# EasyEDA Pro project ProPrj_CC-board_2026-02-09.epro

# Schematic Schematic1
Board Name: Board1; Create Date: 2025-12-28; Page Name: P1; Project Name: CC-board; Schematic Name: Schematic1; Update Date: 2025-12-28; Company: EasyEDA.com; Page Size: A4; Version: V1.0
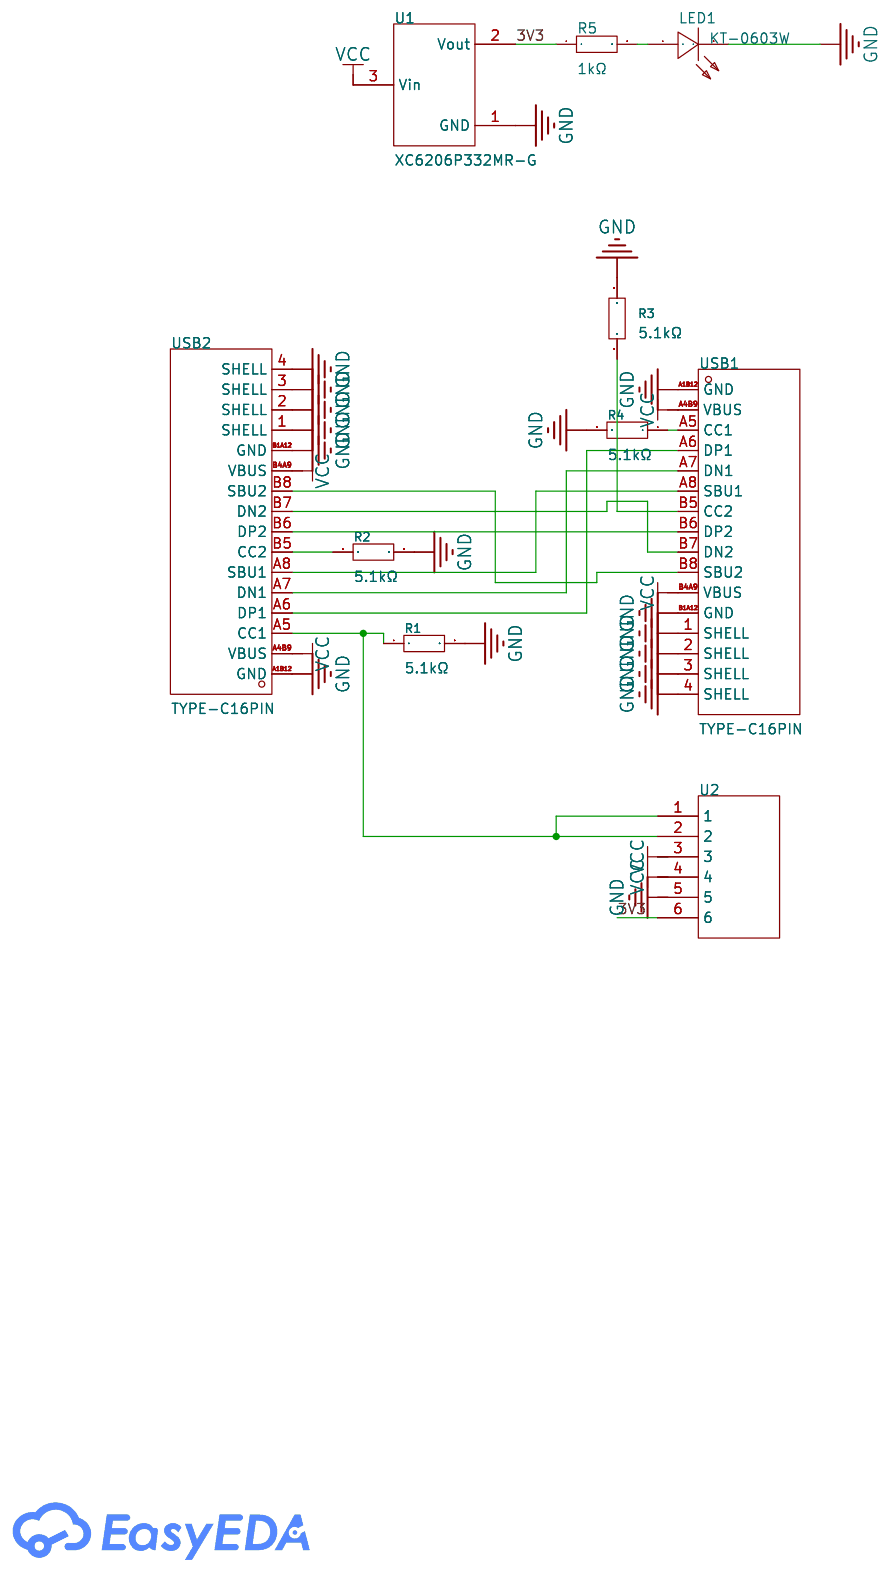
[diagram p0: schematic sheet]

## Parts
LED1  KT-0603W  [LED0603-R-RD_WHITE]
R1  5.1kΩ  [R0402]
R2  5.1kΩ  [R0402]
R3  5.1kΩ  [R0402]
R4  5.1kΩ  [R0402]
R5  1kΩ  [R0402]
U1  XC6206P332MR-G  [SOT-23-3_L2.9-W1.6-P1.90-LS2.8-BR]
U2  -  [tooth]
USB1  TYPE-C16PIN  [USB-C-SMD_TYPE-C16PIN]
USB2  TYPE-C16PIN  [USB-C-SMD_TYPE-C16PIN]

## Library data of the parts
LED1 = KT-0603W: Illumination Color:White Voltage - Forward(Vf):2.6V~3.1V Voltage - Forward(Vf):2.6V~3.1V Power(Watts):100mW Forward Current:5mA Diode Configuration:Discrete Diode Lens Color:Yellow Lens Luminous Intensity:360mcd Luminous Intensity:360mcd Viewing Angle:120; LCSC Part Name: 0603 白灯 高亮; Supplier Part: C2290; Manufacturer: KENTO; Supplier Footprint: 0603; JLCPCB Part Class: Basic Part; Datasheet: https://item.szlcsc.com/datasheet/KT-0603W/2663.html; Supplier: LCSC; Illumination Color: White; Voltage - Forward(Vf): 2.6V~3.1V; Power(Watts): 100mW; Forward Current: 5mA; Diode Configuration: Discrete Diode; Lens Color: Yellow Lens; Luminous Intensity: 360mcd; Viewing Angle: 120°; Mounting Style: Top-mount
R1-R4 = 0402WGF5101TCE: Type:Thick Film Resistor Resistance:5.1kΩ Tolerance:±1% Tolerance:±1% Power(Watts):62.5mW Voltage-Supply(Max):50V Temperature Coefficient:±100ppm/℃ Temperature Coefficient:±100ppm/℃ Operating Temperature:-55℃~+155℃ Operating Temperature:-55℃~+155℃; LCSC Part Name: 5.1kΩ ±1% 62.5mW 厚膜电阻; Supplier Part: C25905; Manufacturer: UNI-ROYAL(厚声); Supplier Footprint: 0402; JLCPCB Part Class: Basic Part; Datasheet: https://item.szlcsc.com/datasheet/0402WGF5101TCE/26648.html; Supplier: LCSC; Type: Thick Film Resistor; Tolerance: ±1%; Power(Watts): 62.5mW; Voltage-Supply(Max): 50V; Temperature Coefficient: ±100ppm/℃; Operating Temperature: -55℃~+155℃
R5 = 0402WGF1001TCE: Type:Thick Film Resistor Resistance:1kΩ Tolerance:±1% Tolerance:±1% Power(Watts):62.5mW Voltage-Supply(Max):50V Temperature Coefficient:±100ppm/℃ Temperature Coefficient:±100ppm/℃ Operating Temperature:-55℃~+155℃ Operating Temperature:-55℃~+155℃; LCSC Part Name: 1kΩ ±1% 62.5mW 厚膜电阻; Supplier Part: C11702; Manufacturer: UNI-ROYAL(厚声); Supplier Footprint: 0402; JLCPCB Part Class: Basic Part; Datasheet: https://item.szlcsc.com/datasheet/0402WGF1001TCE/12256.html; Supplier: LCSC; Type: Thick Film Resistor; Tolerance: ±1%; Power(Watts): 62.5mW; Voltage-Supply(Max): 50V; Temperature Coefficient: ±100ppm/℃; Operating Temperature: -55℃~+155℃
U1 = XC6206P332MR-G_C5446: Output Type:Fixed Voltage - Supply:6V Output Voltage:3.3V Output Voltage:3.3V Output Current:200mA Power Supply Rejection Ratio (PSRR):- Voltage Dropout:- standby current:1uA Noise:- Features:Over Current Protection Operating Temperature:-40℃~+85℃@(Ta) Op; LCSC Part Name: 输入6V 输出3.3V 200mA; Supplier Part: C5446; Manufacturer: TOREX(特瑞仕); Supplier Footprint: SOT-23-3L; JLCPCB Part Class: Basic Part; Datasheet: https://item.szlcsc.com/datasheet/XC6206P332MR-G/5896.html; Supplier: LCSC; Output Type: Fixed; Voltage - Supply: 6V; Output Voltage: 3.3V; Output Current: 200mA; standby current: 1uA; Features: Over Current Protection; Operating Temperature: -40℃~+85℃@(Ta); Output Configuration: Positive; Number of Outputs: 1
U2 = tooth
USB1 USB2 = TYPE-C16PIN: Connector Type:Type-C Protocol Standard:USB 3.1 Gender:Female Mounting Type:Surface Mount, Right Angle Number of Contacts:16P Number of Ports:1 Current Rating-Power:3A Voltage Rating:30V Connect-Disconnect Life:10,000 Cycles Detection color:Black Operatin; LCSC Part Name: Type-C 母 卧贴; Supplier Part: C393939; Manufacturer: SHOU HAN(首韩); Supplier Footprint: SMD; JLCPCB Part Class: Extended Part; Datasheet: https://item.szlcsc.com/datasheet/TYPE-C16PIN/372551.html; Supplier: LCSC; Connector Type: Type-C; Protocol Standard: USB 3.1; Gender: Female; Mounting Type: Surface Mount, Right Angle; Number of Contacts: 16P; Number of Ports: 1; Current Rating-Power: 3A; Voltage Rating: 30V; Connect-Disconnect Life: 10,000 Cycles; Detection color: Black; Operating Temperature: -40℃~+85℃

## Nets
3V3: R5.1 U1.2(Vout) U2.6
GND: LED1.2(K) R1.2 R2.2 R3.2 R4.2 U1.1(GND) U2.5 USB1.1(SHELL) USB1.2(SHELL) USB1.3(SHELL) USB1.4(SHELL) USB1.A1B12(GND) USB1.B1A12(GND) USB2.1(SHELL) USB2.2(SHELL) USB2.3(SHELL) USB2.4(SHELL) USB2.A1B12(GND) USB2.B1A12(GND)
VCC: U1.3(Vin) U2.3 U2.4 USB1.A4B9(VBUS) USB1.B4A9(VBUS) USB2.A4B9(VBUS) USB2.B4A9(VBUS)
$1N573: USB1.A7(DN1) USB2.A7(DN1)
$1N579: USB1.A6(DP1) USB2.A6(DP1)
$1N593: USB1.A8(SBU1) USB2.A8(SBU1)
$1N606: USB1.B6(DP2) USB2.B6(DP2)
$1N611: USB1.B7(DN2) USB2.B7(DN2)
$1N620: USB1.B8(SBU2) USB2.B8(SBU2)
$1N702: R2.1 USB2.B5(CC2)
$1N789: R4.1 USB1.A5(CC1)
$1N836: R3.1 USB1.B5(CC2)
$1N841: R1.1 U2.1 U2.2 USB2.A5(CC1)
$1N1290: LED1.1(A) R5.2

# Board PCB1
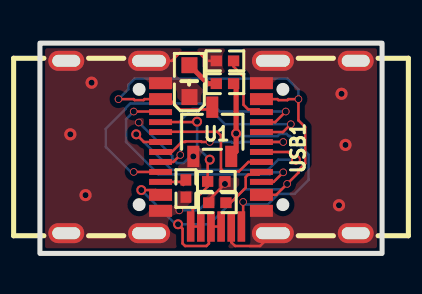
[diagram p1: board, top side]
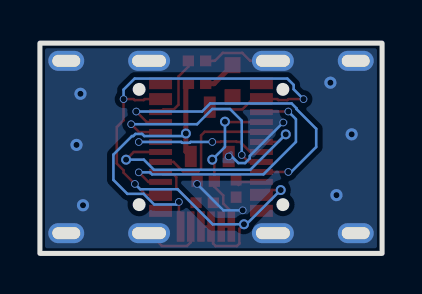
[diagram p2: board, bottom side, seen from below]

Outline 17.14 x 10.54 mm; copper layers: Top Layer, Bottom Layer. Coordinates in mm from the lower left corner of the outline.
Outline path: rectangle 0,10.54 17.14,0
Stack: Top Layer 0.035mm / Dielectric1 1.51mm FR4 er 4.5 / Bottom Layer 0.035mm

## Design rules (mm)
template: Custom Config
spacing copperThickness1oz (default): track to track 0.102, other pairs 0.127 to 0.3
spacing copperThickness2oz: track to track 0.203, other pairs 0.152 to 0.3
track width copperThickness1oz (default): min 0.127, default 0.254, max 2.54
track width copperThickness2oz: min 0.203, default 0.254, max 2.54
differential pair differentialPair (default): width min 0.127, default 0.254, max 2.54; gap min 0.152, default 0.152
via viaSize (default): diameter min 0.381, default 0.61, max 10; hole min 0.3, default 0.305, max 6.3
pour e439 uses copperRegion
pour e401 uses copperRegion

## Placement (name value [footprint] x y rotation side)
LED1  KT-0603W  [LED0603-R-RD_WHITE]  7.49 8.64 90 top
R1  5.1kΩ  [R0402]  8.84 3.61 0 top
R2  5.1kΩ  [R0402]  7.31 3.25 270 top
R3  5.1kΩ  [R0402]  9.27 9.65 180 top
R4  5.1kΩ  [R0402]  8.89 2.54 180 top
R5  1kΩ  [R0402]  9.27 8.51 180 top
U1  XC6206P332MR-G  [SOT-23-3_L2.9-W1.6-P1.90-LS2.8-BR]  8.64 6.1 270 top
U2  -  [tooth]  8.82 0.97 0 top
USB1  TYPE-C16PIN  [USB-C-SMD_TYPE-C16PIN]  13.46 5.33 90 top
USB2  TYPE-C16PIN  [USB-C-SMD_TYPE-C16PIN]  3.68 5.33 270 top

## Footprints (pads in the part's own frame, mm; a bottom-side part is the same pattern mirrored in y, then rotated)
LED0603-R-RD_WHITE
  rect 0.8x0.8 smd: 1(0.8,0) 2(-0.8,0)
R0402
  rect 0.566x0.54 smd: 1(-0.433,0) 2(0.433,0)
SOT-23-3_L2.9-W1.6-P1.90-LS2.8-BR
  rect 1.07x0.6 smd: 1(1.235,-0.95) 2(1.235,0.95) 3(-1.235,0)
tooth
  custom 0.381x1.524 smd: 1(-1.27,0.381) 2(-0.762,0.381) 3(-0.254,0.381) 4(0.254,0.381) 5(0.762,0.381) 6(1.27,0.381)
USB-C-SMD_TYPE-C16PIN
  oval 1x2.1 hole 0.6x1.7: 1(-4.32,1.788) 2(4.32,1.788)
  oval 1x1.8 hole 0.6x1.4: 3(-4.32,-2.362) 4(4.32,-2.362)
  rect 0.6x1.15 smd: A1B12(-3.2,2.362) A4B9(-2.4,2.362) B1A12(3.2,2.362) B4A9(2.4,2.362)
  rect 0.3x1.15 smd: A5(-1.25,2.362) A6(-0.25,2.362) A7(0.25,2.362) A8(1.25,2.362) B5(1.75,2.362) B6(0.75,2.362) B7(-0.75,2.362) B8(-1.75,2.362)

## Nets
As in the schematic.

## Via types
v1: diameter 0.61, hole 0.305, Top Layer to Bottom Layer, 6 vias
v2: diameter 0.381, hole 0.305, Top Layer to Bottom Layer, 16 vias
v3: diameter 0.5, hole 0.305, Top Layer to Bottom Layer, 7 vias

## Routing (per net, layer and track width the routed paths; a pad name or vN(x,y) marks a point on that pad's centre or on a via; arc(x,y) is an arc through that point)
3V3: length 14.3
  Top Layer w0.127: U2.6 10.18,1.44 v2(10.18,2.58)
  Top Layer w0.254: U1.2 9.83,5.11 v3(9.83,6.01) 9.83,8.51
  Bottom Layer w0.127: v3(9.83,6.01) 9.96,5.88 11.92,5.88 12.02,5.99 12.36,5.99 12.47,5.88 12.53,5.88 13.46,4.95 13.46,3.68 12.76,2.98 11.95,2.98 11.42,2.45 10.31,2.45 v2(10.18,2.58)
GND: length 14.8
  Top Layer w0.127: U2.5 9.59,0.56 9.78,0.37 11.03,0.37 USB1.1 ; R3.2 8.84,9.65 8.38,9.65 7.98,10.05 7,10.05 6.61,9.65 5.47,9.65 ; R4.2 8.46,2.67 v2(9.27,3.48)
  Bottom Layer w0.127: v2(7.69,4.86) 7.53,4.86 7.2,4.53 6.86,4.53 6.63,4.77 6.63,4.89 v2(4.95,6.56) ; v2(6.98,2.16) 7.95,2.16 v2(9.27,3.48)
  vias: v1(1.52,5.97) v1(2.29,2.92) v1(2.59,8.56) v1(14.99,2.41) v1(15.11,8) v1(15.31,5.44)
VCC: length 37.3
  Top Layer w0.127: 11.1,2.93 11.84,2.93 v2(12.39,3.48) 12.95,4.05 12.95,4.17 13.29,4.51 13.29,6.33 12.95,6.67 v2(12.95,7.73) 12.45,7.73 12.4,7.68 11.95,7.68 11.9,7.73 USB1.B4A9 ; v3(5.08,3.18) 5.8,3.18 6.05,2.93 ; U1.3 8.6,7.33 8.49,7.22 7,7.22 6.49,7.73 USB2.A4B9 5.25,7.73 5.19,7.68 4.75,7.68 4.7,7.73 v2(3.94,7.73) ; U2.4 U2.3 8.47,1.25 8.47,0.5 8.34,0.37 7.27,0.37 7.15,0.5 7.15,1.23 v3(6.92,1.46)
  Bottom Layer w0.127: v2(12.39,3.48) 12.12,3.21 10.24,3.21 8.49,1.46 v3(6.92,1.46) 6.79,1.46 v3(5.08,3.18) ; v2(3.94,7.73) 4.43,8.23 4.43,8.45 4.75,8.76 12.4,8.76 12.95,8.21 v2(12.95,7.73)
$1N573: length 7.5
  Top Layer w0.127: v2(8.51,5.59) 8.1,5.59 8.08,5.61 7.3,5.61 7.27,5.59 7.11,5.59 6.61,5.08 USB2.A7 ; USB1.A7 v2(12.19,5.58)
  Bottom Layer w0.127: v2(12.19,5.58) 12.19,5.59 10.07,5.59 10.02,5.55 9.64,5.55 9.59,5.59 v2(8.51,5.59)
$1N579: length 12.2
  Top Layer w0.127: USB2.A6 5.21,5.58 v3(4.83,5.97) ; USB1.A6 12.44,5.08 v3(12.83,4.7)
  Bottom Layer w0.127: v3(12.83,4.7) 11.94,4.7 11.43,4.19 6.6,4.19 v3(4.83,5.97)
$1N593: length 15.3
  Top Layer w0.127: USB1.A8 11.79,6.58 v2(12.32,7.11) ; USB2.A8 v2(4.7,4.08)
  Bottom Layer w0.127: v2(4.7,4.08) 4.55,4.08 3.3,5.33 3.3,6.25 4.29,7.24 4.29,7.28 4.53,7.52 8.61,7.52 9.02,7.11 v2(12.32,7.11)
$1N606: length 10.6
  Top Layer w0.127: v2(7.03,4.93) 6.68,4.58 USB2.B6 ; v2(12.57,6.48) 12.18,6.08 USB1.B6
  Bottom Layer w0.127: v2(12.57,6.48) 9.27,6.48 8.51,7.24 7.62,7.24 7.03,6.65 v2(7.03,4.93)
$1N611: length 7.1
  Top Layer w0.127: USB1.B7 10.45,4.58 9.97,4.11 9.2,4.11 9.07,4.24 9.07,5.92 8.89,6.1 6.06,6.1 USB2.B7
$1N620: length 12.9
  Top Layer w0.127: v2(12.19,4.06) 11.71,3.58 USB1.B8 ; USB2.B8 6.02,7.11 v2(4.7,7.11)
  Bottom Layer w0.127: v2(4.7,7.11) 4.32,6.73 4.32,5.59 5.94,3.96 11.52,3.96 11.63,4.06 v2(12.19,4.06)
$1N702: length 1.2
  Top Layer w0.127: 7.19,3.43 7.03,3.58 USB2.B5
$1N789: length 2.7
  Top Layer w0.127: R4.1 9.56,2.54 10.31,3.29 10.31,3.82 10.44,3.95 10.97,3.95 USB1.A5
$1N836: length 3.5
  Top Layer w0.127: R3.1 9.7,9.37 10.2,8.87 10.2,7.45 10.44,7.22 10.97,7.22 USB1.B5
$1N841: length 8.3
  Top Layer w0.127: v3(7.87,6.6) 7.85,6.58 USB2.A5 ; U2.2 U2.1 7.66,1.45 7.66,2.2 7.96,2.5 7.96,2.9 8.41,3.35 R1.1 8.41,4.6 v3(8.51,4.7)
  Bottom Layer w0.127: v3(7.87,6.6) 7.87,5.33 v3(8.51,4.7)
$1N1290: length 1.9
  Top Layer w0.254: 8.97,8.51 8.42,8.51 LED1.1

## Copper pours and planes (outline as drawn; the poured copper is in the pictures)
GND on Top Layer: -3.3,12.32 19.43,12.32 19.43,-1.52 -3.3,-1.52
GND on Bottom Layer: -5.21,13.46 22.61,13.46 22.61,-3.05 -5.21,-3.05
